# EasyEDA schematic SCH_Automotive.json
TITLE: Sheet_1; REV: 1.0; Date: 2021-11-28; Sheet: 1/1; Drawn By: Manaam Rehan; Company: Your Company
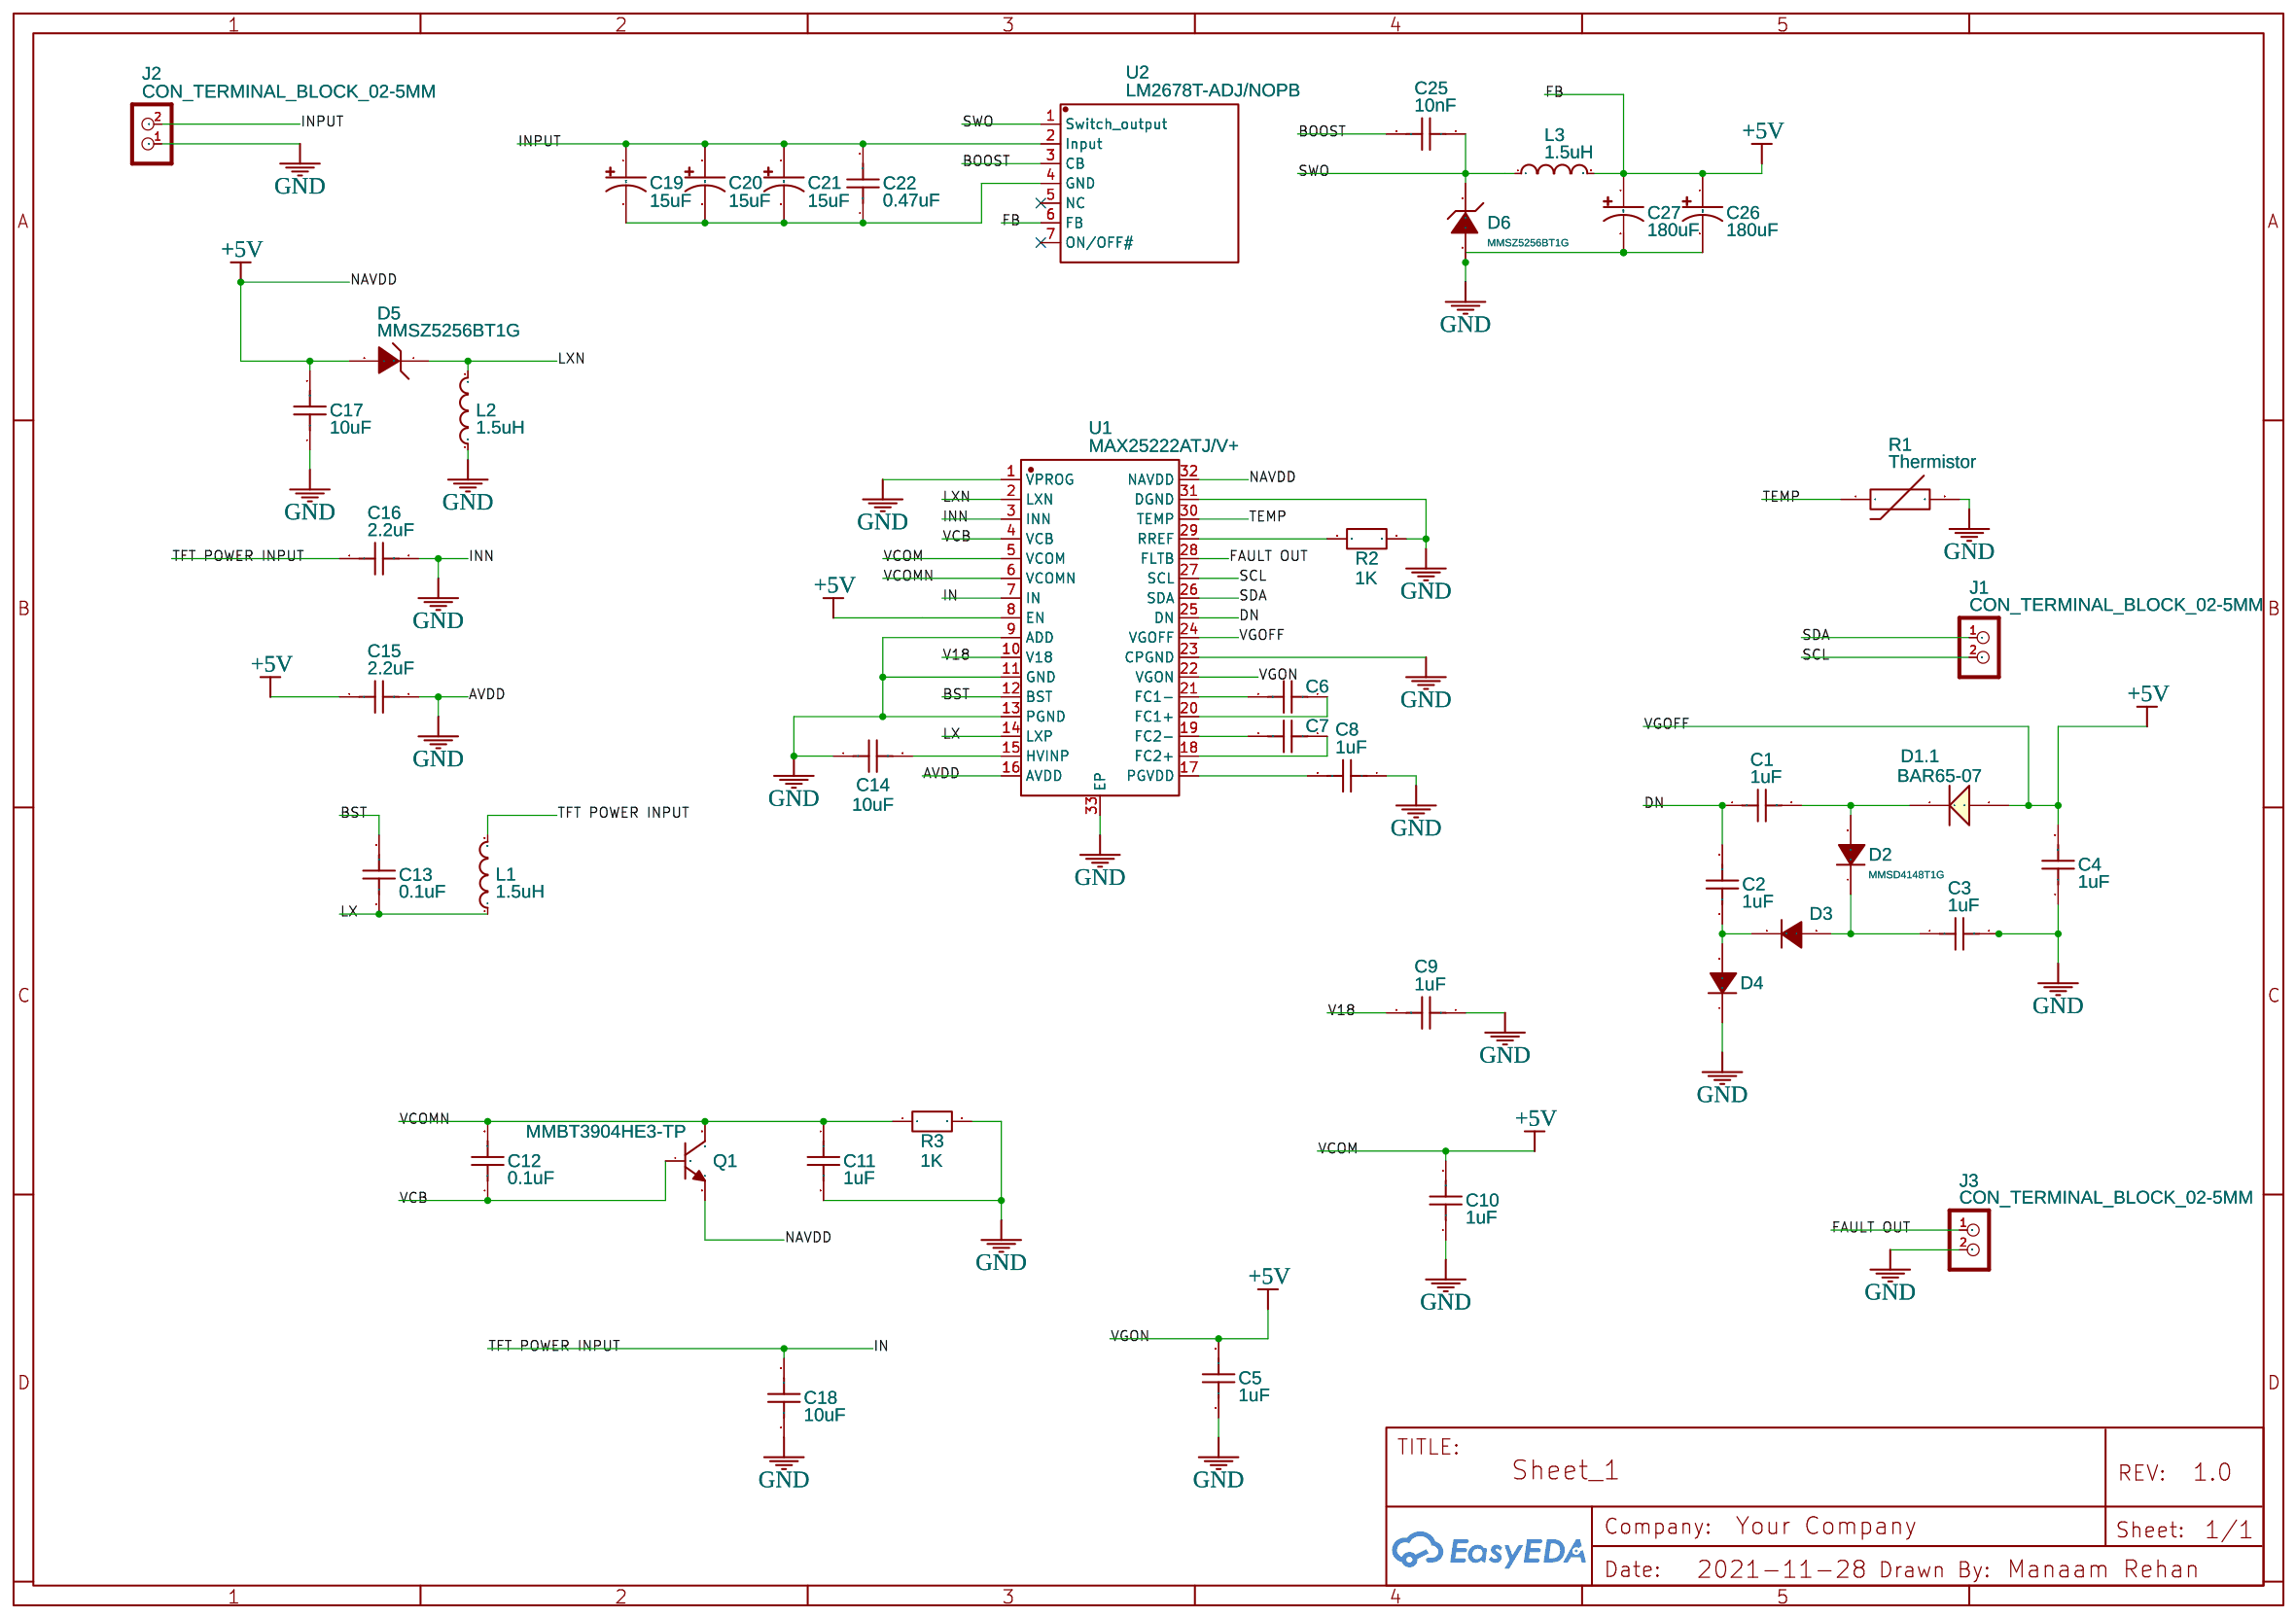
[diagram p0: schematic sheet]

## Parts
C1  1uF  [C0603]
C2  1uF  [C0603]
C3  1uF  [C0603]
C4  1uF  [C0603]
C5  1uF  [C0603]
C6  1uF  [C0603]
C7  1uF  [C0603]
C8  1uF  [C0603]
C9  1uF  [C0603]
C10  1uF  [C0603]
C11  1uF  [C0603]
C12  0.1uF  [C0603]
C13  0.1uF  [C0603]
C14  10uF  [C1206]
C15  2.2uF  [C0603]
C16  2.2uF  [C0603]
C17  10uF  [C1206]
C18  10uF  [C1206]
C19  15uF  [CAP-TH_BD10.0-P5.00-D1.0-FD]
C20  15uF  [CAP-TH_BD10.0-P5.00-D1.0-FD]
C21  15uF  [CAP-TH_BD10.0-P5.00-D1.0-FD]
C22  0.47uF  [CAP-TH_L18.0-W8.5-P15.00-D0.8]
C25  10nF  [C0603]
C26  180uF  [CAP-SMD_BD5.0-L5.3-W5.3-FD]
C27  180uF  [CAP-SMD_BD5.0-L5.3-W5.3-FD]
D1  BAR65-07  [SOT-143]  (section 1)
D2  MMSD4148T1G  [SOD-123_L2.8-W1.8-LS3.7-RD]
D3  MMSD4148T1G  [SOD-123_L2.8-W1.8-LS3.7-RD]
D4  MMSD4148T1G  [SOD-123_L2.8-W1.8-LS3.7-RD]
D5  MMSZ5256BT1G  [SOD-123_L2.7-W1.6-LS3.7-RD-1]
D6  MMSZ5256BT1G  [SOD-123_L2.7-W1.6-LS3.7-RD-1]
J1  CON_TERMINAL_BLOCK_02-5MM  [TERMINAL_BLOCK_2P_5]
J2  CON_TERMINAL_BLOCK_02-5MM  [TERMINAL_BLOCK_2P_5]
J3  CON_TERMINAL_BLOCK_02-5MM  [TERMINAL_BLOCK_2P_5]
L1  1.5uH  [L0603]
L2  1.5uH  [L0603]
L3  1.5uH  [L0603]
Q1  MMBT3904HE3-TP  [SOT-23-3_L2.9-W1.3-P1.90-LS2.4-BR]
R1  Thermistor  [RES-TH_L2.5-W2.5-P1.70-D0.3]
R2  1K  [R0402]
R3  1K  [R0402]
U1  MAX25222ATJ/V+  [TQFN-32_L5.0-W5.0-P0.50-BL-EP]
U2  LM2678T-ADJ/NOPB  [TO-220-7-L10.5-W4.5-P1.27-BL]

## Library data of the parts
C1-C11 = CS1608X7R105K250NRB: Supplier: LCSC; Supplier Part: C513775; Manufacturer: Samwha Capacitor; Contributor: LCSC
C12 C13 = 0603BB104K500NGT: Supplier: LCSC; Supplier Part: C2168571; Manufacturer: Knowles(楼氏); JLCPCB Part Class: Extended Part; Contributor: LCSC
C14 C17 C18 = CS3216X7R106K250NRI: Supplier: LCSC; Supplier Part: C513767; Manufacturer: Samwha Capacitor; Contributor: LCSC
C15 C16 = CS1608X7R225K100NRB: Supplier: LCSC; Supplier Part: C516003; Manufacturer: Samwha Capacitor; Contributor: LCSC
C19-C21 = NFA 450V15uF: Supplier: LCSC; Supplier Part: C165688; Manufacturer: SamYoung Electronics; Contributor: LCSC; JLCPCB Part Class: Extended Part
C22 = MPX-474K275VAC-C-D4: Supplier: LCSC; Supplier Part: C2761810; Manufacturer: CORETONG(芯通）; JLCPCB Part Class: Extended Part; Contributor: LCSC
C25 = CT41G-0603-2X1-50V-0.01UF-K(N): Supplier: LCSC; Supplier Part: C136131; Manufacturer: TORCH; Manufacturer Part: CT41G-0603-2X1-50V-0.01uF-K(N); Contributor: LCSC; JLCPCB Part Class: Extended Part
C26 C27 = 6SVPE180M: Supplier: LCSC; Supplier Part: C178382; Manufacturer: PANASONIC; Contributor: LCSC; JLCPCB Part Class: Extended Part
D1 = BAR65-07: Low-Loss, Low Capacitance RF Switching PIN Diode; subpart_no: 1
D2-D4 = MMSD4148T1G: Supplier: LCSC; Manufacturer: ON; Supplier Part: C11177; JLCPCB Part Class: Extended Part
D5 D6 = MMSZ5256BT1G: Supplier: LCSC; Supplier Part: C235773; Manufacturer: ON Semicon; Contributor: LCSC; JLCPCB Part Class: Extended Part
J1-J3 = CON_TERMINAL_BLOCK_02-5MM: 2 poles wire to board terminal block; Contributor: DangerousPrototype
L1-L3 = MLF1608A1R5JT000: Supplier: LCSC; Manufacturer: TDK; Supplier Part: C87514; JLCPCB Part Class: Extended Part
Q1 = MMBT3904HE3-TP: Supplier: LCSC; Supplier Part: C779219; Manufacturer: MCC(Micro Commercial Components); Contributor: LCSC; JLCPCB Part Class: Extended Part
R1 = MF52A1502F3470: Supplier: LCSC; Manufacturer: Shiheng; Supplier Part: C72411; JLCPCB Part Class: Extended Part
R2 R3 = PTFR0402D1K00P9: Supplier: LCSC; Supplier Part: C375969; Manufacturer: ResistorToday; Contributor: LCSC
U1 = MAX25222ATJ/V+: Supplier: LCSC; Supplier Part: C1019992; Manufacturer: MAXIM(美信); Contributor: LCSC
U2 = LM2678T-ADJ/NOPB: Supplier: LCSC; Supplier Part: C95178; Manufacturer: Texas Instruments; Contributor: LCSC; JLCPCB Part Class: Extended Part

## Nets
+5V: C4.2 C5.2 C10.2 C15.1 C17.2 C26.1 C27.1 D1.3(A) D5.2(A) L3.2 Q1.2(E) U1.5(VCOM) U1.8(EN) U1.22(VGON) U1.24(VGOFF) U1.32(NAVDD) U2.6(FB)
AVDD: C3.2 C4.1 C5.1 C8.1 C9.1 C10.1 C11.2 C14.1 C15.2 C16.2 C17.1 C18.1 C26.2 C27.2 D4.1(C) D6.2(A) J2.1 J3.2 L2.1 R1.2 R2.2 R3.2 U1.1(VPROG) U1.3(INN) U1.9(ADD) U1.11(GND) U1.13(PGND) U1.16(AVDD) U1.23(CPGND) U1.31(DGND) U1.33(EP)
V18: C9.2 U1.10(V18)
BOOST: C25.2 U2.3(CB)
BST: C13.2 U1.12(BST)
DN: C1.1 C2.2 U1.25(DN)
FAULT OUT: J3.1 U1.28(FLTB)
IN: C16.1 C18.2 L1.2 U1.7(IN)
INPUT: C19.1 C20.1 C21.1 C22.2 J2.2 U2.2(Input)
LX: C13.1 L1.1 U1.14(LXP)
LXN: D5.1(C) L2.2 U1.2(LXN)
SCL: J1.2 U1.27(SCL)
SDA: J1.1 U1.26(SDA)
SWO: C25.1 D6.1(C) L3.1 U2.1(Switch_output)
TEMP: R1.1 U1.30(TEMP)
VCB: C12.1 Q1.1(B) U1.4(VCB)
VCOMN: C11.1 C12.2 Q1.3(C) R3.1 U1.6(VCOMN)
Net-(C1-2): C1.2 D1.2(K) D2.2(A)
Net-(C2-1): C2.1 D3.1(C) D4.2(A)
Net-(C3-1): C3.1 D2.1(C) D3.2(A)
Net-(C6-1): C6.1 U1.20(FC1+)
Net-(C6-2): C6.2 U1.21(FC1-)
Net-(C7-1): C7.1 U1.18(FC2+)
Net-(C7-2): C7.2 U1.19(FC2-)
Net-(C8-2): C8.2 U1.17(PGVDD)
Net-(C14-2): C14.2 U1.15(HVINP)
Net-(C19-2): C19.2 C20.2 C21.2 C22.1 U2.4(GND)
Net-(R2-1): R2.1 U1.29(RREF)

Not connected (* = marked no-connect by the designer): U2 5(NC)* 7(ON/OFF#)*
